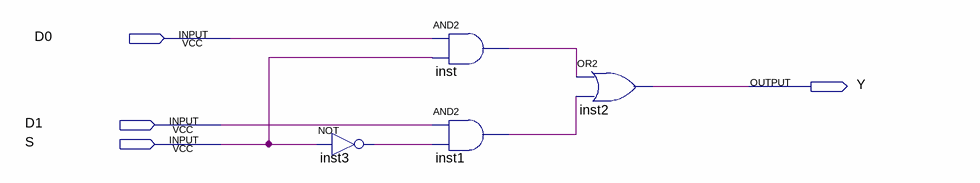
[diagram p0: schematic sheet]
// Quartus schematic MUX21.bdf as structural Verilog: 4 symbols, 4 pins
module MUX21 (
  input  D0,
  input  D1,
  input  S,
  output Y
);

  wire inst1_out, inst3_out, inst_out;

  not inst3 (inst3_out, S);
  and inst (inst_out, D0, S);
  and inst1 (inst1_out, D1, inst3_out);
  or inst2 (Y, inst_out, inst1_out);
endmodule
